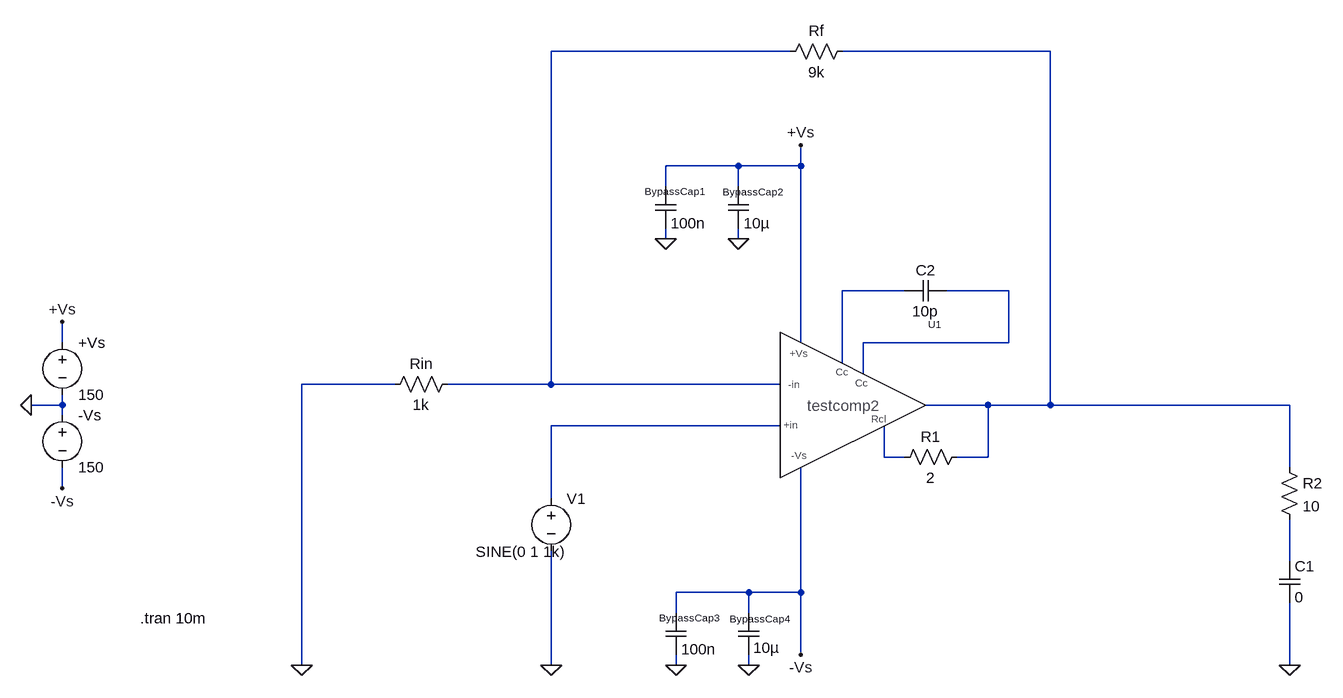
[diagram p0: schematic testcomp2.asc]
testcomp2.asc, the LTspice schematic file:
Version 4
SHEET 1 1648 1280
WIRE 144 -384 -224 -384
WIRE 544 -384 224 -384
WIRE 64 -208 -48 -208
WIRE 160 -208 160 -240
WIRE 160 -208 64 -208
WIRE -48 -176 -48 -208
WIRE 64 -176 64 -208
WIRE -48 -96 -48 -112
WIRE 64 -96 64 -112
WIRE 320 -16 224 -16
WIRE 480 -16 384 -16
WIRE -976 64 -976 32
WIRE 160 64 160 -208
WIRE 480 64 480 -16
WIRE 480 64 256 64
WIRE 224 96 224 -16
WIRE 256 112 256 64
WIRE -464 128 -608 128
WIRE -224 128 -224 -384
WIRE -224 128 -384 128
WIRE 128 128 -224 128
WIRE -976 160 -976 144
WIRE -976 160 -1024 160
WIRE 448 160 352 160
WIRE 544 160 544 -384
WIRE 544 160 448 160
WIRE 912 160 544 160
WIRE -976 176 -976 160
WIRE 128 192 -224 192
WIRE 288 240 288 192
WIRE 320 240 288 240
WIRE 448 240 448 160
WIRE 448 240 400 240
WIRE 912 256 912 160
WIRE -976 288 -976 256
WIRE -224 304 -224 192
WIRE 912 400 912 336
WIRE 80 448 -32 448
WIRE 160 448 160 256
WIRE 160 448 80 448
WIRE -32 480 -32 448
WIRE 80 480 80 448
WIRE 160 544 160 448
WIRE -608 560 -608 128
WIRE -224 560 -224 384
WIRE -32 560 -32 544
WIRE 80 560 80 544
WIRE 912 560 912 464
FLAG -224 560 0
FLAG -608 560 0
FLAG -1024 160 0
FLAG -976 32 +Vs
FLAG 160 -240 +Vs
FLAG -976 288 -Vs
FLAG 160 544 -Vs
FLAG 912 560 0
FLAG -32 560 0
FLAG 80 560 0
FLAG -48 -96 0
FLAG 64 -96 0
SYMBOL voltage -976 48 R0
WINDOW 123 0 0 Left 0
WINDOW 39 0 0 Left 0
SYMATTR InstName +Vs
SYMATTR Value 150
SYMBOL voltage -976 160 R0
WINDOW 123 0 0 Left 0
WINDOW 39 0 0 Left 0
SYMATTR InstName -Vs
SYMATTR Value 150
SYMBOL cap -48 480 R0
WINDOW 0 -10 7 Left 1
SYMATTR InstName BypassCap3
SYMATTR Value 100n
SYMBOL cap 64 480 R0
WINDOW 0 -13 9 Left 1
WINDOW 3 23 53 Left 2
SYMATTR InstName BypassCap4
SYMATTR Value 10µ
SYMBOL cap 48 -176 R0
WINDOW 0 -8 8 Left 1
SYMATTR InstName BypassCap2
SYMATTR Value 10µ
SYMBOL cap -64 -176 R0
WINDOW 0 -16 7 Left 1
SYMATTR InstName BypassCap1
SYMATTR Value 100n
SYMBOL res 240 -400 R90
WINDOW 0 0 56 VBottom 2
WINDOW 3 32 56 VTop 2
SYMATTR InstName Rf
SYMATTR Value 9k
SYMBOL res -368 112 R90
WINDOW 0 0 56 VBottom 2
WINDOW 3 32 56 VTop 2
SYMATTR InstName Rin
SYMATTR Value 1k
SYMBOL voltage -224 288 R0
WINDOW 123 -34 128 Left 2
WINDOW 39 0 0 Left 0
WINDOW 3 -116 98 Left 2
SYMATTR Value SINE(0 1 1k)
SYMATTR InstName V1
SYMBOL cap 384 -32 R90
WINDOW 0 0 32 VBottom 2
WINDOW 3 32 32 VTop 2
SYMATTR InstName C2
SYMATTR Value 10p
SYMBOL testcomp2 144 160 R0
SYMATTR InstName U1
SYMBOL res 416 224 R90
WINDOW 0 0 56 VBottom 2
WINDOW 3 32 56 VTop 2
SYMATTR InstName R1
SYMATTR Value 2
SYMBOL cap 896 400 R0
SYMATTR InstName C1
SYMATTR Value 0
SYMBOL res 896 240 R0
SYMATTR InstName R2
SYMATTR Value 10
TEXT -856 488 Left 2 !.tran 10m

The netlist it stands for:
* testcomp2.asc
V§+Vs +Vs 0 150
V§-Vs 0 -Vs 150
C§BypassCap3 -Vs 0 100n
C§BypassCap4 -Vs 0 10µ
C§BypassCap2 +Vs 0 10µ
C§BypassCap1 +Vs 0 100n
Rf N002 N001 9k
Rin N001 0 1k
V1 N005 0 SINE(0 1 1k)
C2 N004 N003 10p
XU1 N005 N001 N006 N002 +Vs -Vs N004 N003 testcomp testcomp  ; pins +in -in Rcl out +V -V Cc1 Cc2
R1 N002 N006 2
C1 N007 0 0
R2 N002 N007 10
.tran 10m
.lib testcomp.lib
.backanno
.end